# Altium schematic sheet 04-2 m8 io 1.SchDoc
size A3; SheetNumber: 6; SheetTotal: 16
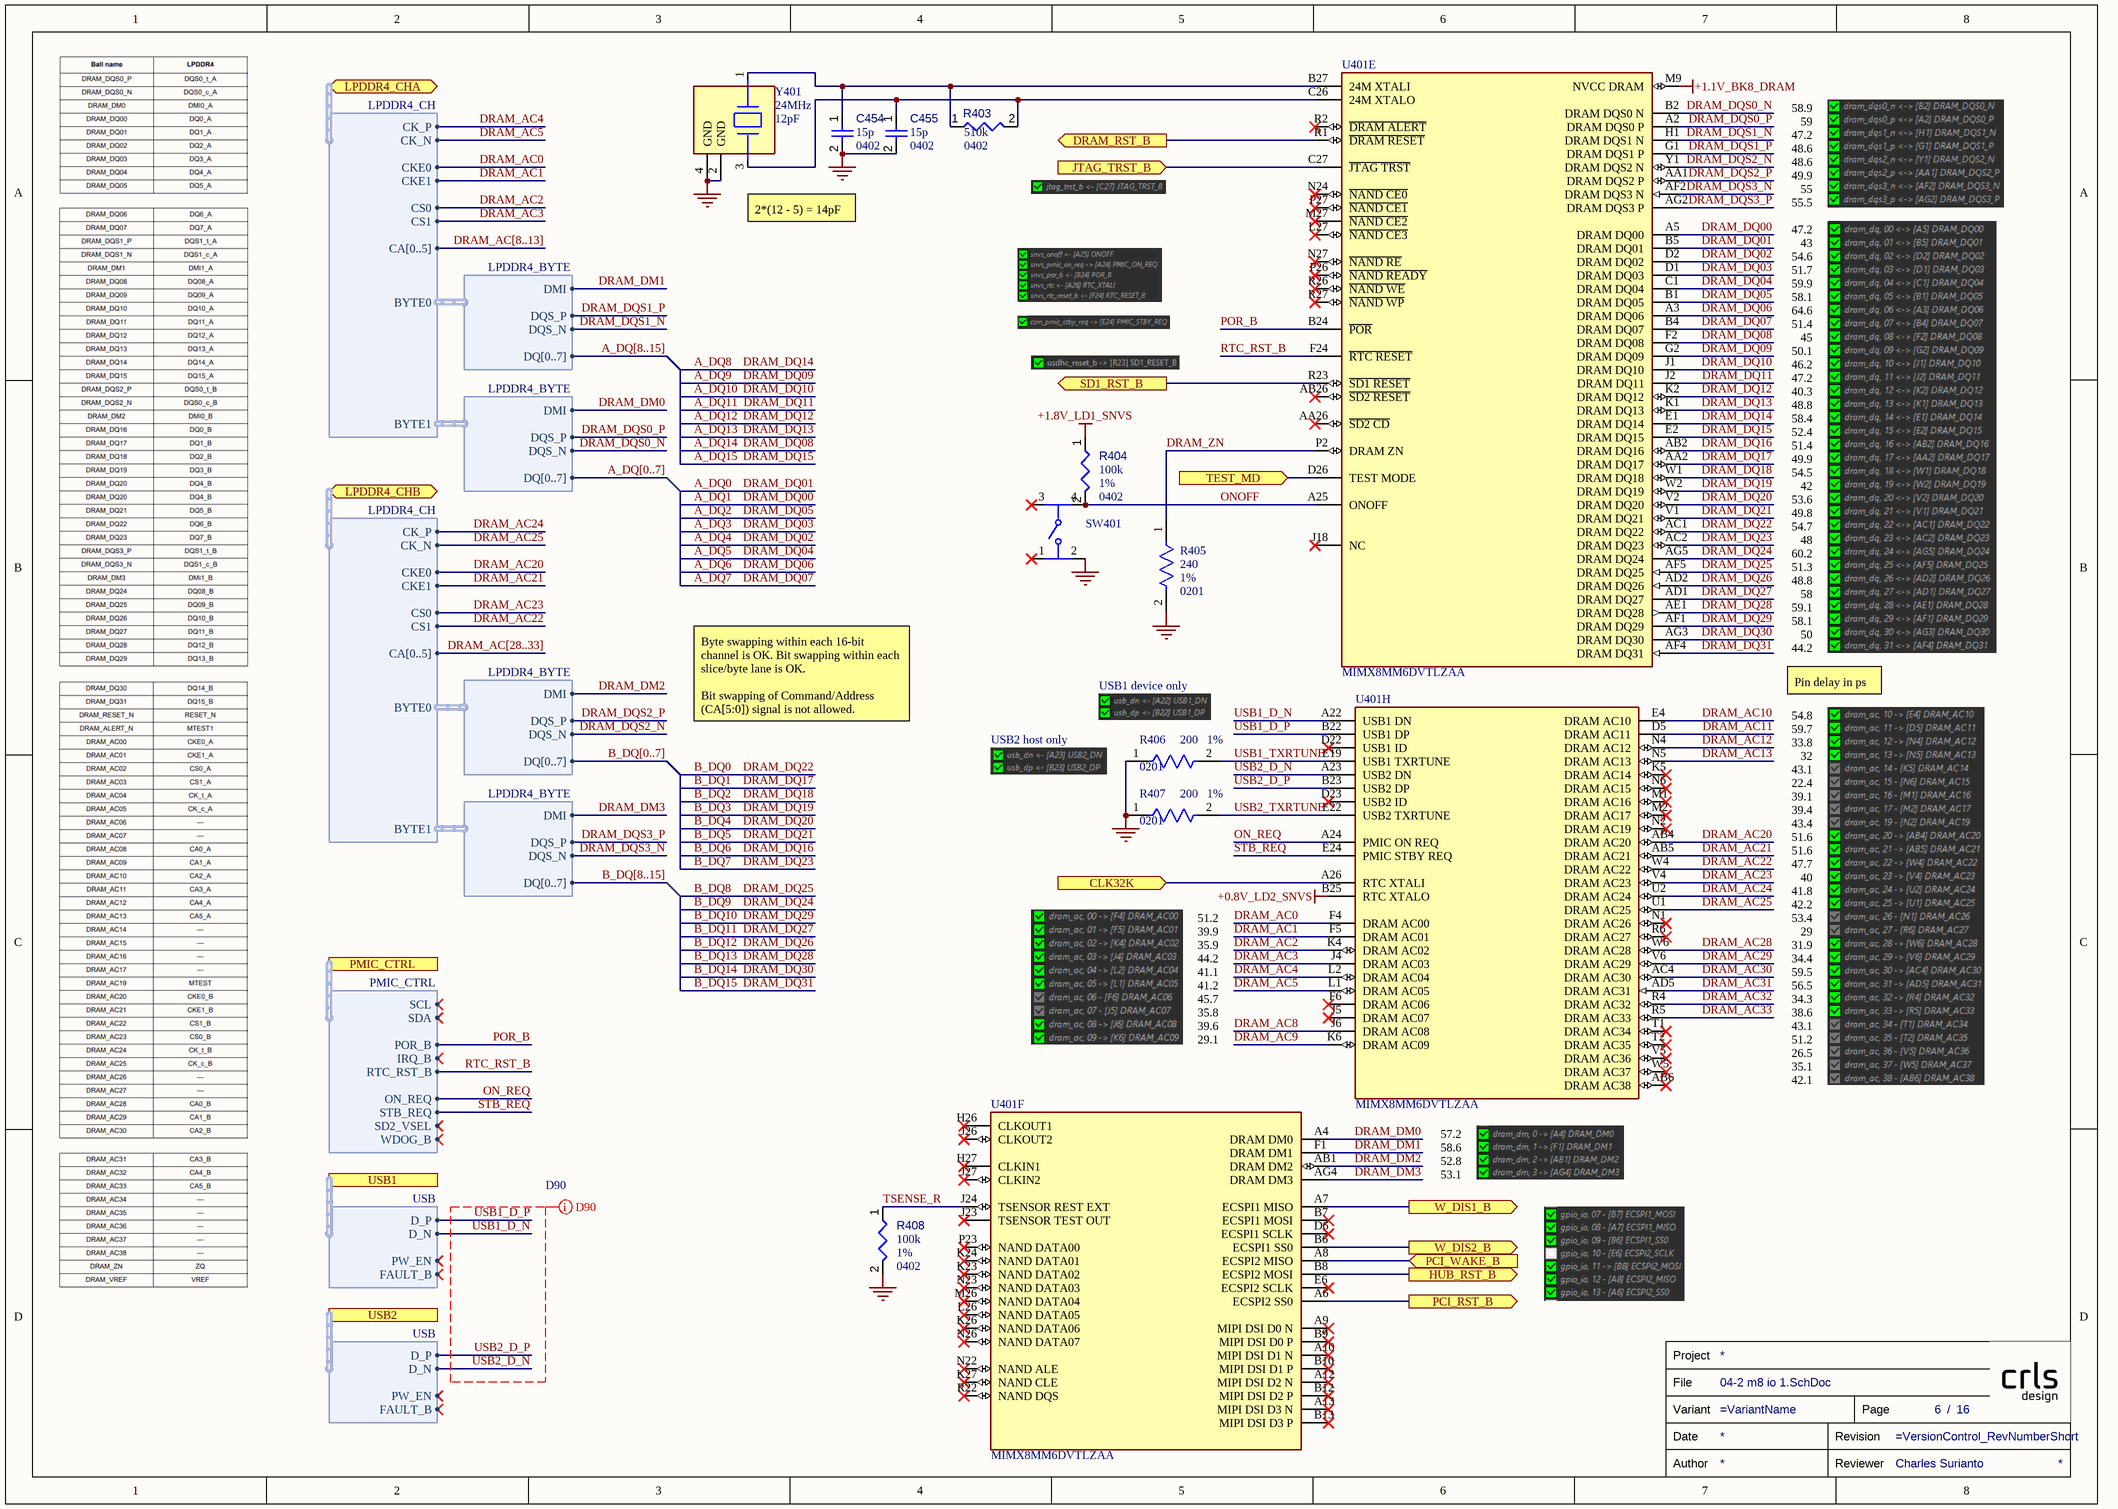
[diagram p0: 04-2 m8 io 1.SchDoc]

## Parts
C454  value 15p  Case/Package: 0402  [CAPC0402(1005)60_L]  (hidden comment: Capacitors,0402,15p)
C455  value 15p  Case/Package: 0402  [CAPC0402(1005)60_L]  (hidden comment: Capacitors,0402,15p)
R403  value 510k  Case/Package: 0402  [RESC0402(1005)_L]  (hidden comment: Resistors,0402,1%,510k)
R404  value 100k  Case/Package: 0402  Tolerance: 1%  [RESC0402(1005)_L]  (hidden comment: Resistors,0402,1%,100k)
R405  Tolerance: 1%  Case/Package: 0201  Resistance: 240  [FP-RMCF0201-MFG]  (hidden comment: RMCF0201FG240R)
R406  value 200  Tolerance: 1%  Case: 0201  [FP-ERJ1GN-MFG]  (hidden comment: ERJ-1GNF2000C)
R407  value 200  Tolerance: 1%  Case: 0201  [FP-ERJ1GN-MFG]  (hidden comment: ERJ-1GNF2000C)
R408  value 100k  Case/Package: 0402  Tolerance: 1%  [RESC0402(1005)_L]  (hidden comment: Resistors,0402,1%,100k)
SW401  PTS810SJM250SMTRLFS  [FP-PTS810SJM250SMTRLFS-MFG]  (value not drawn)
TB?  Reviewer: Charles Surianto  (hidden comment: TITLE_BLOCK)  (graphical)
U401  MIMX8MM6DVTLZAA  [FP-SOT1967-2-IPC_A]  (parts E,F,H of 11)
Y401  Load Capacitance: 12pF  Frequency: 24MHz  [FP-TSX-3225-MFG]  (hidden comment: TSX-3225 24.0000MF20G-AC3)

## Ports
CLK32K (in), DRAM_RST_B (out), HUB_RST_B (out), JTAG_TRST_B (in), LPDDR4_CHA (bidir, harness LPDDR4_CH), LPDDR4_CHB (bidir, harness LPDDR4_CH), PCI_RST_B (out), PCI_WAKE_B (in), PMIC_CTRL (harness PMIC_CTRL), SD1_RST_B (out), TEST_MD (in), USB1 (harness USB), USB2 (harness USB), W_DIS1_B (out), W_DIS2_B (out)

## Harnesses
LPDDR4_CH: CK_P, CK_N, CKE0, CKE1, CA[0..5], CS1, CS0, BYTE0, BYTE1
LPDDR4_BYTE: DMI, DQS_P, DQS_N, DQ[0..7]
PMIC_CTRL: SCL, SDA, IRQ_B, POR_B, RTC_RST_B, ON_REQ, STB_REQ, SD2_VSEL, WDOG_B
USB: PW_EN, FAULT_B, D_P, D_N

## Nets
+0.8V_LD2_SNVS: U401.B25(RTC_XTALO)
+1.1V_BK8_DRAM: U401.M9(NVCC_DRAM)
+1.8V_LD1_SNVS: R404.1
GND: C454.2 C455.2 R405.2 R406.1 R407.1 R408.2 SW401.2 Y401.2(GND) Y401.4(GND)
A_DQ0: U401.B5(DRAM_DQ01)  [also labelled DRAM_DQ01]
A_DQ1: U401.A5(DRAM_DQ00)  [also labelled DRAM_DQ00]
A_DQ2: U401.B1(DRAM_DQ05)  [also labelled DRAM_DQ05]
A_DQ3: U401.D1(DRAM_DQ03)  [also labelled DRAM_DQ03]
A_DQ4: U401.D2(DRAM_DQ02)  [also labelled DRAM_DQ02]
A_DQ5: U401.C1(DRAM_DQ04)  [also labelled DRAM_DQ04]
A_DQ6: U401.A3(DRAM_DQ06)  [also labelled DRAM_DQ06]
A_DQ7: U401.B4(DRAM_DQ07)  [also labelled DRAM_DQ07]
A_DQ8: U401.E1(DRAM_DQ14)  [also labelled DRAM_DQ14]
A_DQ9: U401.G2(DRAM_DQ09)  [also labelled DRAM_DQ09]
A_DQ10: U401.J1(DRAM_DQ10)  [also labelled DRAM_DQ10]
A_DQ11: U401.J2(DRAM_DQ11)  [also labelled DRAM_DQ11]
A_DQ12: U401.K2(DRAM_DQ12)  [also labelled DRAM_DQ12]
A_DQ13: U401.K1(DRAM_DQ13)  [also labelled DRAM_DQ13]
A_DQ14: U401.F2(DRAM_DQ08)  [also labelled DRAM_DQ08]
A_DQ15: U401.E2(DRAM_DQ15)  [also labelled DRAM_DQ15]
B_DQ0: U401.AC1(DRAM_DQ22)  [also labelled DRAM_DQ22]
B_DQ1: U401.AA2(DRAM_DQ17)  [also labelled DRAM_DQ17]
B_DQ2: U401.W1(DRAM_DQ18)  [also labelled DRAM_DQ18]
B_DQ3: U401.W2(DRAM_DQ19)  [also labelled DRAM_DQ19]
B_DQ4: U401.V2(DRAM_DQ20)  [also labelled DRAM_DQ20]
B_DQ5: U401.V1(DRAM_DQ21)  [also labelled DRAM_DQ21]
B_DQ6: U401.AB2(DRAM_DQ16)  [also labelled DRAM_DQ16]
B_DQ7: U401.AC2(DRAM_DQ23)  [also labelled DRAM_DQ23]
B_DQ8: U401.AF5(DRAM_DQ25)  [also labelled DRAM_DQ25]
B_DQ9: U401.AG5(DRAM_DQ24)  [also labelled DRAM_DQ24]
B_DQ10: U401.AF1(DRAM_DQ29)  [also labelled DRAM_DQ29]
B_DQ11: U401.AD1(DRAM_DQ27)  [also labelled DRAM_DQ27]
B_DQ12: U401.AD2(DRAM_DQ26)  [also labelled DRAM_DQ26]
B_DQ13: U401.AE1(DRAM_DQ28)  [also labelled DRAM_DQ28]
B_DQ14: U401.AG3(DRAM_DQ30)  [also labelled DRAM_DQ30]
B_DQ15: U401.AF4(DRAM_DQ31)  [also labelled DRAM_DQ31]
CLK32K: U401.A26(RTC_XTALI) ; port CLK32K
DRAM_AC0: U401.F4(DRAM_AC00) ; port LPDDR4_CHA.CKE0
DRAM_AC1: U401.F5(DRAM_AC01) ; port LPDDR4_CHA.CKE1
DRAM_AC2: U401.K4(DRAM_AC02) ; port LPDDR4_CHA.CS0
DRAM_AC3: U401.J4(DRAM_AC03) ; port LPDDR4_CHA.CS1
DRAM_AC4: U401.L2(DRAM_AC04) ; port LPDDR4_CHA.CK_P
DRAM_AC5: U401.L1(DRAM_AC05) ; port LPDDR4_CHA.CK_N
DRAM_AC8: U401.J6(DRAM_AC08)
DRAM_AC9: U401.K6(DRAM_AC09)
DRAM_AC10: U401.E4(DRAM_AC10)
DRAM_AC11: U401.D5(DRAM_AC11)
DRAM_AC12: U401.N4(DRAM_AC12)
DRAM_AC13: U401.N5(DRAM_AC13)
DRAM_AC20: U401.AB4(DRAM_AC20) ; port LPDDR4_CHB.CKE0
DRAM_AC21: U401.AB5(DRAM_AC21) ; port LPDDR4_CHB.CKE1
DRAM_AC22: U401.W4(DRAM_AC22) ; port LPDDR4_CHB.CS1
DRAM_AC23: U401.V4(DRAM_AC23) ; port LPDDR4_CHB.CS0
DRAM_AC24: U401.U2(DRAM_AC24) ; port LPDDR4_CHB.CK_P
DRAM_AC25: U401.U1(DRAM_AC25) ; port LPDDR4_CHB.CK_N
DRAM_AC28: U401.W6(DRAM_AC28)
DRAM_AC29: U401.V6(DRAM_AC29)
DRAM_AC30: U401.AC4(DRAM_AC30)
DRAM_AC31: U401.AD5(DRAM_AC31)
DRAM_AC32: U401.R4(DRAM_AC32)
DRAM_AC33: U401.R5(DRAM_AC33)
DRAM_DM0: U401.A4(DRAM_DM0) ; harness LPDDR4_BYTE.DMI
DRAM_DM1: U401.F1(DRAM_DM1) ; harness LPDDR4_BYTE.DMI
DRAM_DM2: U401.AB1(DRAM_DM2) ; harness LPDDR4_BYTE.DMI
DRAM_DM3: U401.AG4(DRAM_DM3) ; harness LPDDR4_BYTE.DMI
DRAM_DQS0_N: U401.B2(DRAM_DQS0_N) ; harness LPDDR4_BYTE.DQS_N
DRAM_DQS0_P: U401.A2(DRAM_DQS0_P) ; harness LPDDR4_BYTE.DQS_P
DRAM_DQS1_N: U401.H1(DRAM_DQS1_N) ; harness LPDDR4_BYTE.DQS_N
DRAM_DQS1_P: U401.G1(DRAM_DQS1_P) ; harness LPDDR4_BYTE.DQS_P
DRAM_DQS2_N: U401.Y1(DRAM_DQS2_N) ; harness LPDDR4_BYTE.DQS_N
DRAM_DQS2_P: U401.AA1(DRAM_DQS2_P) ; harness LPDDR4_BYTE.DQS_P
DRAM_DQS3_N: U401.AF2(DRAM_DQS3_N) ; harness LPDDR4_BYTE.DQS_N
DRAM_DQS3_P: U401.AG2(DRAM_DQS3_P) ; harness LPDDR4_BYTE.DQS_P
DRAM_RST_B: U401.R1(~{DRAM_RESET}) ; port DRAM_RST_B
DRAM_ZN: R405.1 U401.P2(DRAM_ZN)
HUB_RST_B: U401.B8(ECSPI2_MOSI) ; port HUB_RST_B
JTAG_TRST_B: U401.C27(~{JTAG_TRST}) ; port JTAG_TRST_B
ON_REQ: U401.A24(PMIC_ON_REQ) ; port PMIC_CTRL.ON_REQ
ONOFF: R404.2 SW401.4 U401.A25(ONOFF)
PCI_RST_B: U401.A6(ECSPI2_SS0) ; port PCI_RST_B
PCI_WAKE_B: U401.A8(ECSPI2_MISO) ; port PCI_WAKE_B
POR_B: U401.B24(~{POR}) ; port PMIC_CTRL.POR_B
RTC_RST_B: U401.F24(~{RTC_RESET}) ; port PMIC_CTRL.RTC_RST_B
SD1_RST_B: U401.R23(~{SD1_RESET}) ; port SD1_RST_B
STB_REQ: U401.E24(PMIC_STBY_REQ) ; port PMIC_CTRL.STB_REQ
TEST_MD: U401.D26(TEST_MODE) ; port TEST_MD
TSENSE_R: R408.1 U401.J24(TSENSOR_REST_EXT)
USB1_D_N: U401.A22(USB1_DN) ; port USB1.D_N
USB1_D_P: U401.B22(USB1_DP) ; port USB1.D_P
USB1_TXRTUNE: R406.2 U401.E19(USB1_TXRTUNE)
USB2_D_N: U401.A23(USB2_DN) ; port USB2.D_N
USB2_D_P: U401.B23(USB2_DP) ; port USB2.D_P
USB2_TXRTUNE: R407.2 U401.E22(USB2_TXRTUNE)
W_DIS1_B: U401.A7(ECSPI1_MISO) ; port W_DIS1_B
W_DIS2_B: U401.B6(ECSPI1_SS0) ; port W_DIS2_B
NetC454_1: C454.1 R403.1 U401.B27(24M_XTALI) Y401.1
NetC455_1: C455.1 R403.2 U401.C26(24M_XTALO) Y401.3

Not connected (* = marked no-connect by the designer): SW401 1* 3*; U401 A9(MIPI_DSI_D0_N)* A10(MIPI_DSI_D1_N)* A12(MIPI_DSI_D2_N)* A13(MIPI_DSI_D3_N)* AA26(~{SD2_CD})* AB6(DRAM_AC38)* AB26(~{SD2_RESET})* B7(ECSPI1_MOSI)* B9(MIPI_DSI_D0_P)* B10(MIPI_DSI_D1_P)* B12(MIPI_DSI_D2_P)* B13(MIPI_DSI_D3_P)* D6(ECSPI1_SCLK)* D22(USB1_ID)* D23(USB2_ID)* E6(ECSPI2_SCLK)* F6(DRAM_AC06)* H26(CLKOUT1)* H27(CLKIN1)* J5(DRAM_AC07)* J18(NC)* J23(TSENSOR_TEST_OUT)* J26(CLKOUT2)* J27(CLKIN2)* K5(DRAM_AC14)* K23(NAND_DATA02)* K24(NAND_DATA01)* K26(NAND_DATA06)* K27(NAND_CLE)* L26(NAND_DATA05)* L27(~{NAND_CE3})* M1(DRAM_AC16)* M2(DRAM_AC17)* M26(NAND_DATA04)* M27(~{NAND_CE2})* N1(DRAM_AC26)* N2(DRAM_AC19)* N6(DRAM_AC15)* N22(NAND_ALE)* N23(NAND_DATA03)* N24(~{NAND_CE0})* N26(NAND_DATA07)* N27(~{NAND_RE})* P23(NAND_DATA00)* P26(~{NAND_READY})* P27(~{NAND_CE1})* R2(~{DRAM_ALERT})* R6(DRAM_AC27)* R22(NAND_DQS)* R26(~{NAND_WE})* R27(~{NAND_WP})* T1(DRAM_AC34)* T2(DRAM_AC35)* V5(DRAM_AC36)* W5(DRAM_AC37)*

## Buses and harness runs
bus A_DQ[0..7]
bus A_DQ[8..15]
bus B_DQ[0..7]
bus B_DQ[8..15]
bus DRAM_AC[8..13]
bus DRAM_AC[28..33]

## Layout directives
differential pair; differential pair class D90: USB1_D_N, USB1_D_P, USB2_D_N, USB2_D_P

## Notes on the sheet
- 2*(12 - 5) = 14pF
- 58.9
  59
  47.2
  48.6
  48.6
  49.9
  55
  55.5
- 47.2
  43
  54.6
  51.7
  59.9
  58.1
  64.6
  51.4
  45
  50.1
  46.2
  47.2
  40.3
  48.8
  58.4
  52.4
  51.4
  49.9
  54.5
  42
  53.6
  49.8
  54.7
  48
  60.2
  51.3
  48.8
  58
  59.1
  58.1
  50
  44.2
- Byte swapping within each 16-bit channel is OK. Bit swapping within each slice/byte lane is OK.
  Bit swapping of Command/Address (CA[5:0]) signal is not allowed.
- USB1 device only
- Pin delay in ps
- USB2 host only
- 51.2
  39.9
  35.9
  44.2
  41.1
  41.2
  45.7
  35.8
  39.6
  29.1
- 54.8
  59.7
  33.8
  32
  43.1
  22.4
  39.1
  39.4
  43.4
  51.6
  51.6
  47.7
  40
  41.8
  42.2
  53.4
  29
  31.9
  34.4
  59.5
  56.5
  34.3
  38.6
  43.1
  51.2
  26.5
  35.1
  42.1
- (near U401) 57.2
  58.6
  52.8
  53.1
- (in symbol TITLE_BLOCK) Project; File; Variant; Page; /; Date; Revision; Author; Reviewer

## Library data of the parts
C454 C455 = Capacitors: Capacitor; Component Type: Capacitors
R403 R404 R408 = Resistors: Resistor; Component Type: Resistors
  R403: Tolerance: 1%
R405 = CMP-26527-006303-1: 240Ω ±1% 0.05W 0201 Thick Film Chip Resistor AEC-Q200 compliant; Temperature Coefficient: 200ppm/°C; Max Power Dissipation: 50mW; Resistor Type: Thick Film; Case Code (Imperial): 0201; Case Code (Metric): 0603; Min Operating Temperature: -55°C; Length: 0.024inch; Packaging: Tape and Reel; Max Operating Temperature: 125°C; Number of Terminations: 2; Width: 0.012inch; Height: 0.009inch
R406 R407 = CMP-2004-03479-2: RES SMD 200 OHM 1% 1/20W 0201; Manufacturer: Panasonic Electronic Components; Power Rating: 0.05W; Automotive Grade: Grade 1; Temperature Coefficient: 200ppm/°C; Resistance: 200Ω; Voltage Rating: 25V; Height: 0.26mm; Mouser Description: Thick Film Resistors - SMD 0201 200ohm 1% HalogenFree AEC-Q200; Composition: Thick Film; Footprint Url: https://industrial.panasonic.com/cdbs/www-data/pdf/RDA0000/DMA0000COL17.pdf; Manufacturer Part Number: ERJ-1GNF2000C; Temperature Range High: +125°C; Automotive: Yes; Package: ERJ1GN; Octopart: https://octopart.com/erj-1gnf2000c-panasonic-55419768; Device Class L3: Chip SMD Resistors; Category: Res; ComponentLink2URL: https://industrial.panasonic.com/cdbs/www-data/pdf/RDA0000/AOA0000C304.pdf; Digikey Description: RES SMD 200 OHM 1% 1/20W 0201; Temperature: -55°C to +125°C; Temperature Range Low: -55°C; ComponentLink2Description: Datasheet; Series: ERJ; RoHS: TRUE; Lead Free: Yes; Device Class L2: Resistors; Device Class L1: Passive Components
SW401 = CMP-10040-000001-2: SWITCH TACTILE SPST-NO 0.05A 16V; Throw Configuration: SPST; Operating Force: 160gf; Actuator Type: Standard; Switch Travel: 0.15mm; Switch Function: Off-Mom; Max Current Rating: 50mA; Mechanical Life: 150000Cycles; Illumination Type: Non-Illuminated; Package Quantity: 2900; Depth: 4.6mm; Mount: Surface Mount; Packaging: Tape and Reel; Length: 3.2mm; RoHS Compliant: Yes; Case/Package: SMD/SMT; Voltage Rating (DC): 16V; Min Operating Temperature: -40°C; Termination: J-Bend; Lead Free: Lead Free; Contact Plating: Silver; Orientation: Straight; Max Operating Temperature: 85°C; Current Rating: 50mA; Color: Black
U401 = CMP-10096-000012-1: IC MPU I.MX 8M MINI QUAD BGA; RoHS Compliant: Yes
Y401 = CMP-36405-000018-1: CRYSTAL 24.0000MHZ 9PF SMD; ESR (Equivalent Series Resistance): 40R; Frequency Stability: 20ppm; Tolerance: 10ppm; Drive Level: 200uW; Min Operating Temperature: -40°C; RoHS Compliant: Yes; Width: 2.5mm; Max Operating Temperature: 105°C; Package Quantity: 250; Mount: Surface Mount; Lead Free: Lead Free; Height: 0.024inch; Depth: 2.5mm; Packaging: Tape and Reel; Series: TSX-3225; Weight: 0.000564oz; Number of Pins: 4; Termination: SMD/SMT; Case/Package: SMD/SMT; Length: 3.2mm; Frequency Tolerance: 10ppm
TB? = TITLE_BLOCK: Review Date: *